# EAGLE design MCChipProto (EAGLE 9.1.0)
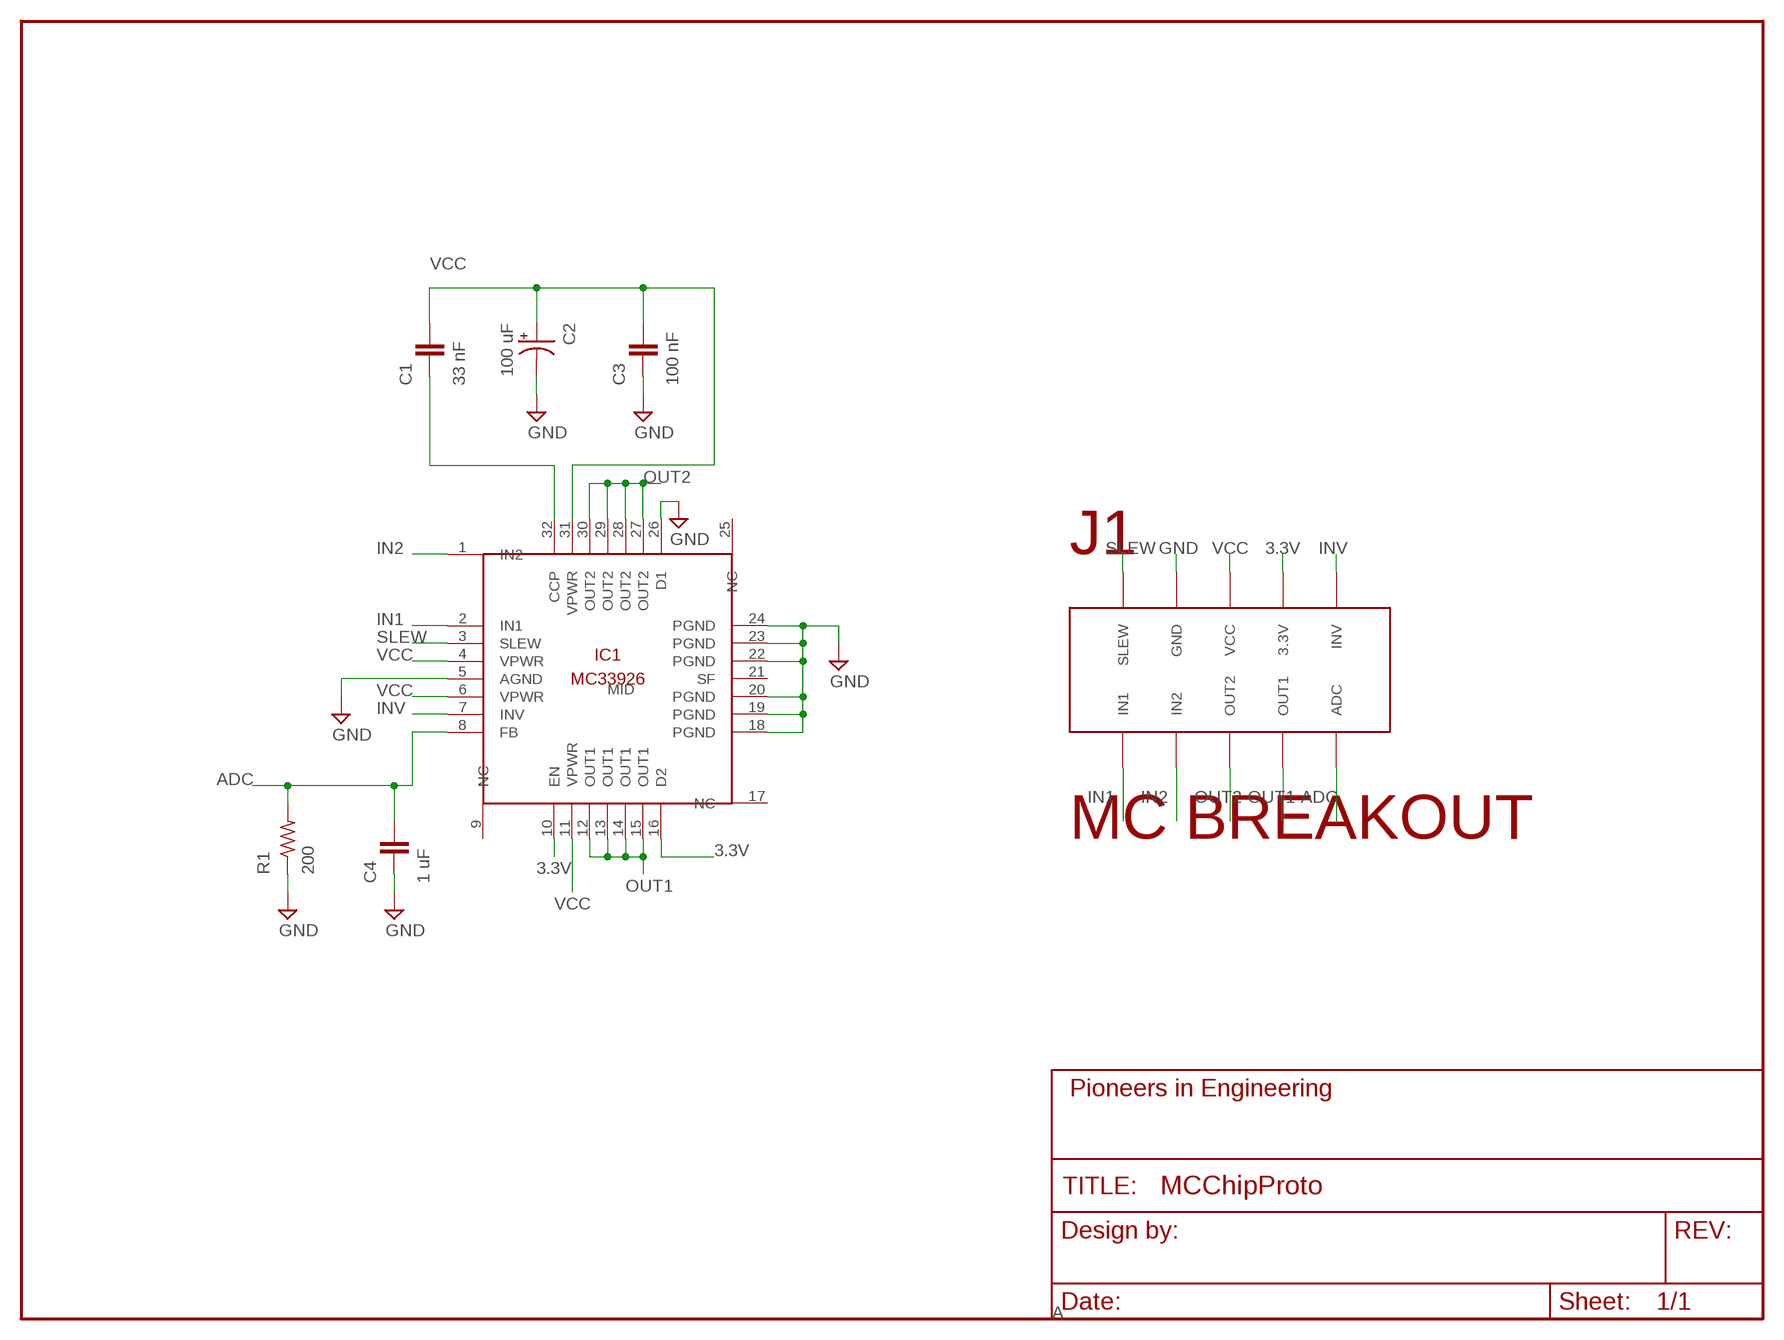
[diagram p0: schematic, sheet 1]
FRAME1 (FRAME_SCHEMATIC): AUTHOR: Steven L; REVISION: A

## Parts
C1  33 nF  CAP0603-CAP  [0603-CAP]
C2  100 uF  CAP_POLRADIAL  [.248"CAP_THRU]
C3  100 nF  CAP0603-CAP  [0603-CAP]
C4  1 uF  CAP0603-CAP  [0603-CAP]
IC1  MC33926  [PQFN-32]
J1  MC BREAKOUT  2X5PIN  [2X5PIN]
R1  200  R-US_R0603  [R0603]

## Nets
3.3V: IC1.10(EN) IC1.16(D2) J1.3.3V
ADC: C4.2 IC1.8(FB) J1.ADC R1.2
GND: C2.MINUS(-) C3.1 C4.1 IC1.5(AGND) IC1.18(PGND) IC1.19(PGND) IC1.20(PGND) IC1.22(PGND) IC1.23(PGND) IC1.24(PGND) IC1.26(D1) J1.GND R1.1
IN1: IC1.2(IN1) J1.IN1
IN2: IC1.1(IN2) J1.IN2
INV: IC1.7(INV) J1.INV
N$2: C1.1 IC1.32(CCP)
OUT1: IC1.12(OUT1) IC1.13(OUT1) IC1.14(OUT1) IC1.15(OUT1) J1.OUT1
OUT2: IC1.27(OUT2) IC1.28(OUT2) IC1.29(OUT2) IC1.30(OUT2) J1.OUT2
SLEW: IC1.3(SLEW) J1.SLEW
VCC: C1.2 C2.PLUS(+) C3.2 IC1.4(VPWR) IC1.6(VPWR) IC1.11(VPWR) IC1.31(VPWR) J1.VCC
Unconnected: IC1.9(NC) IC1.17(NC) IC1.21(SF) IC1.25(NC) IC1.MID(AGND)

## Library data of the parts
C1 C3 C4 = pie:CAP: Capacitor Standard 0603 ceramic capacitor, and 0.1" leaded capacitor.; PIE-INT-REF-NUM: CAPACITOR-GENERIC
C2 = pie:CAP_POL: Capacitor Polarized These are standard SMD and PTH capacitors. Normally 10uF, 47uF, and 100uF in electrolytic and tantalum varieties. Always verify the external diameter of the through hole cap, it varies with capacity, voltage, and manufacturer. The EIA devices should be standard.
IC1 = pie:MC33926: https://www.nxp.com/docs/en/data-sheet/MC33926.pdf
J1 = pie:2X5PIN: 10 pin breakout for motor controller chip test board
R1 = pie:R-US_: RESISTOR, American symbol; DESCRIPTION: RESISTOR, American symbol; DISTRIBUTOR: DigiKey; MANUFACTURER: Rohm Semiconductor; NOTES: Cut Tape; PACKAGE: R0603; VALUE: >VALUE

## Board
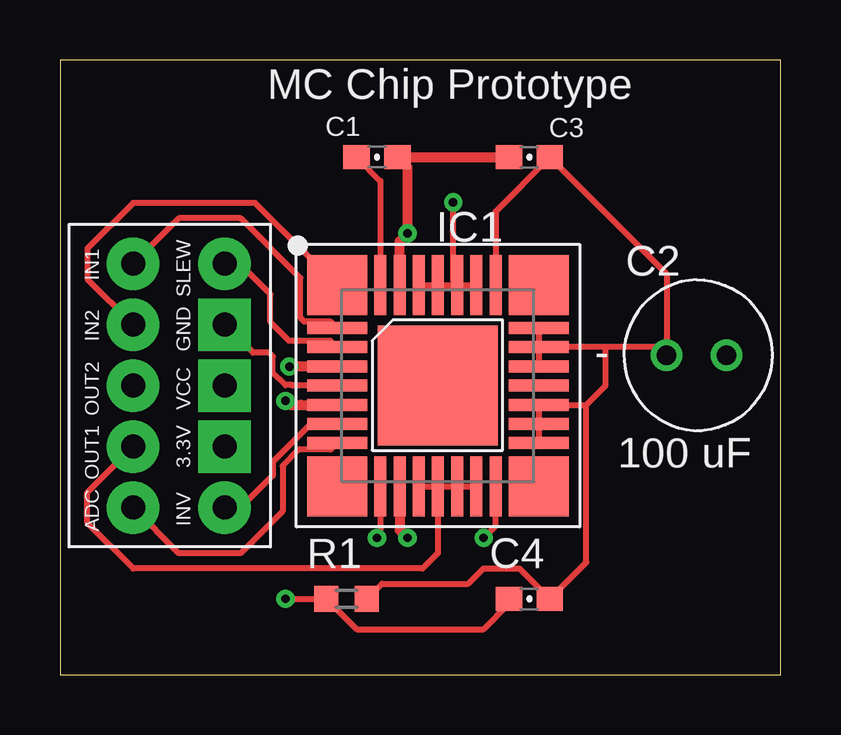
[diagram p1: board, top side]
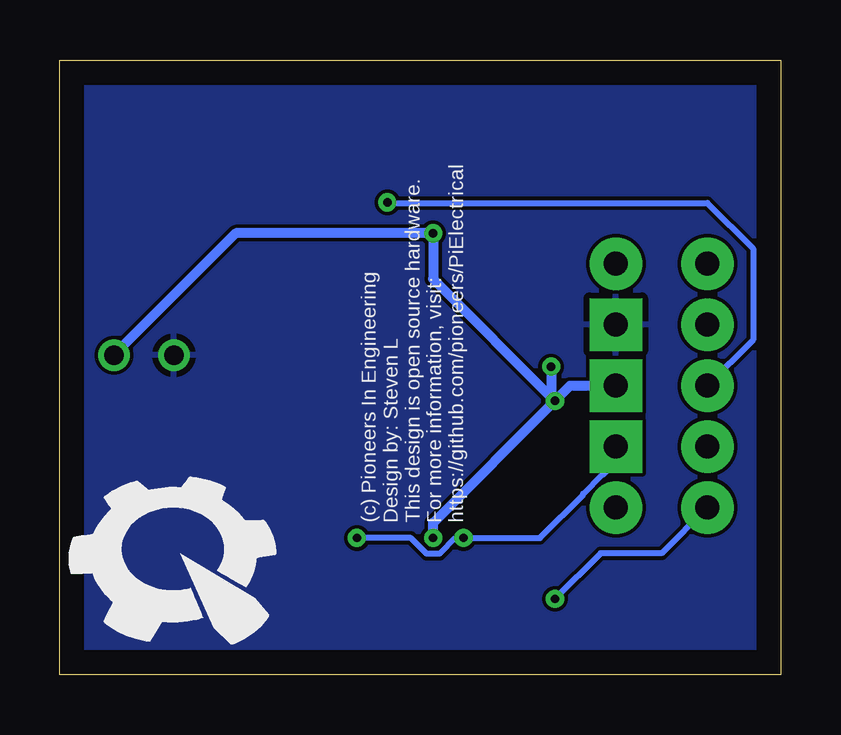
[diagram p2: board, bottom side, seen from below]

Size 30.02 x 25.64 mm. Coordinates in mm from the lower left corner, seen from the top.
Outline: 0,0 30.02,0 30.02,25.64 0,25.64 0,0
Copper layers (1*16): Top 0.035mm / dielectric 1.5mm / Bottom 0.035mm
Design rules "default": minimum track width 6mil, minimum drill 0.35mm, track to track 6mil, track to pad 6mil, pad to pad 6mil, via to via 6mil, smd to smd 6mil, copper to edge 40mil, drill to drill 6mil, minimum pad ring 10mil, minimum via ring 8mil, stop-mask expansion 4mil, vias tented up to drill 0mil, thermal gap 10mil

### Footprints (pad centres in the part's own frame; a part is rotated, then mirrored left to right if it is on the bottom)
0603-CAP = smd 1.1 x 1: 1 -0.85,0; 2 0.85,0
.248"CAP_THRU = drill 0.8: MINUS 0,0; PLUS 2.5,0
PQFN-32 = smd 2.5 x 2.5: 1 -4.2,4.2; 9 -4.2,-4.2; 17 4.2,-4.2; 25 4.2,4.2 | smd 2.5 x 0.5: 2 -4.2,2.4; 3 -4.2,1.6; 4 -4.2,0.8; 5 -4.2,0; 6 -4.2,-0.8; 7 -4.2,-1.6; 8 -4.2,-2.4; 18 4.2,-2.4; 19 4.2,-1.6; 20 4.2,-0.8; 21 4.2,0; 22 4.2,0.8; 23 4.2,1.6; 24 4.2,2.4 | smd 0.5 x 2.5: 10 -2.4,-4.2; 11 -1.6,-4.2; 12 -0.8,-4.2; 13 0,-4.2; 14 0.8,-4.2; 15 1.6,-4.2; 16 2.4,-4.2; 26 2.4,4.2; 27 1.6,4.2; 28 0.8,4.2; 29 0,4.2; 30 -0.8,4.2; 31 -1.6,4.2; 32 -2.4,4.2 | smd 5 x 5: MID 0,0
2X5PIN = drill 1 pad 2.184 square: 3.3V 8.89,-2.54; GND 3.81,-2.54; VCC 6.35,-2.54 | drill 1 pad 2.184: ADC 11.43,-6.35; IN1 1.27,-6.35; IN2 3.81,-6.35; INV 11.43,-2.54; OUT1 8.89,-6.35; OUT2 6.35,-6.35; SLEW 1.27,-2.54
R0603 = smd 1 x 1.1: 1 -0.85,0; 2 0.85,0

### Placement (x,y rotation side)
C1  13.21,21.59 0 top
C2  25.27,13.34 0 top
C3  19.56,21.59 180 top
C4  19.56,3.17 180 top
IC1  15.75,12.06 0 top
J1  9.4,18.41 270 top
R1  11.94,3.17 180 top
U$1  [PIE-LOGO-SMALL]  25.02,5.08 0 bottom

### Tracks (layer width: path | path; a pad name or v marks a point on that pad's centre or on a via)
3.3V  (via drill 0.35)
  Top 0.254: IC1.10 13.35,5.86 v13.21,5.71 | v17.65,5.71 18.15,6.21 IC1.16
  Bottom 0.254: v17.65,5.71 15.41,5.71 14.75,5.06 14.21,5.06 13.55,5.71 v13.21,5.71 10.03,5.71 8.23,7.52 8.23,7.55 7.43,8.36 7.39,8.36 6.86,8.89 J1.3.3V
ADC  (via drill 0.35)
  Top 0.254: IC1.8 11.28,9.39 9.96,9.39 9.27,8.71 9.27,6.82 7.53,5.08 4.95,5.08 J1.ADC | v9.4,3.17 R1.2 12.36,1.91 17.65,1.91 18.71,2.96 C4.2
  Bottom 0.254: J1.ADC 4.95,5.08 7.49,5.08 v9.4,3.17
GND
  Top 0.254: IC1.24 IC1.23 | IC1.23 IC1.22 | IC1.18 IC1.19 IC1.20 21.93,11.27 | 22.73,13.66 24.94,13.66 C2.MINUS 25.27,16.73 C3.1 18.15,19.33 IC1.26 | 22.73,13.66 IC1.23 | IC1.5 9.69,12.06 9.67,12.09 9.4,12.09 8.87,12.62 8.87,13.27 8.7,13.44 8.05,13.44 6.88,14.61 J1.GND | 21.93,11.27 22.73,12.06 22.73,13.66 | R1.1 13.42,3.81 17.02,3.81 17.65,4.45 19.14,4.45 C4.1 21.93,4.7 21.93,11.27
  pour Bottom: 0,0 0,25.65 29.97,25.65 29.97,0
IN1
  Top 0.254: IC1.2 11.28,14.74 10.18,14.74 10.02,14.9 10.02,16.56 7.53,19.05 7.49,19.05 4.95,19.05 J1.IN1
IN2
  Top 0.254: IC1.1 8.13,19.68 3.05,19.68 1.14,17.78 1.14,16.51 J1.IN2
INV
  Top 0.254: IC1.7 10.45,10.46 8.87,8.88 8.87,8.32 7.53,6.99 J1.INV
N$2
  Top 0.254: C1.1 13.35,20.6 IC1.32
OUT1
  Top 0.254: IC1.12 IC1.13 | IC1.13 IC1.14 IC1.15 | IC1.13 15.75,5.08 15.11,4.45 3.05,4.45 1.14,6.35 1.14,7.62 J1.OUT1
OUT2  (via drill 0.35)
  Top 0.254: IC1.30 IC1.29 IC1.28 | IC1.28 IC1.27 | IC1.28 16.38,16.43 v16.38,19.71
  Bottom 0.254: J1.OUT2 1.14,13.97 1.14,17.78 3.05,19.68 16.36,19.68 v16.38,19.71
SLEW
  Top 0.254: IC1.3 11.28,13.94 9.55,13.94 9.46,14.03 9.38,14.1 8.76,14.72 8.76,15.88 7.49,17.14 J1.SLEW
VCC  (via drill 0.35)
  Top 0.254: IC1.4
  Top 0.406: IC1.11 14.15,6.04 v14.48,5.71 | v9.4,11.43 9.56,11.27 10.03,11.27 IC1.6 | IC1.31 14.15,18.09 v14.48,18.41 14.48,20.95 14.48,21.17 C1.2 C3.2 | IC1.4 v9.56,12.86
  Bottom 0.254: 9.56,11.59 v9.4,11.43
  Bottom 0.406: v14.48,5.71 14.48,6.35 v9.4,11.43 | v9.4,11.43 14.48,16.51 v14.48,18.41 22.69,18.41 C2.PLUS | J1.VCC 8.76,12.06 v9.4,11.43 | v9.56,12.86 9.56,11.59

### Text on the board
tPlace: MC Chip Prototype
bPlace: (c) Pioneers In Engineering / Design by: Steven L / This design is open source hardware. / For more information, visit: / https://github.com/pioneers/PiElectrical